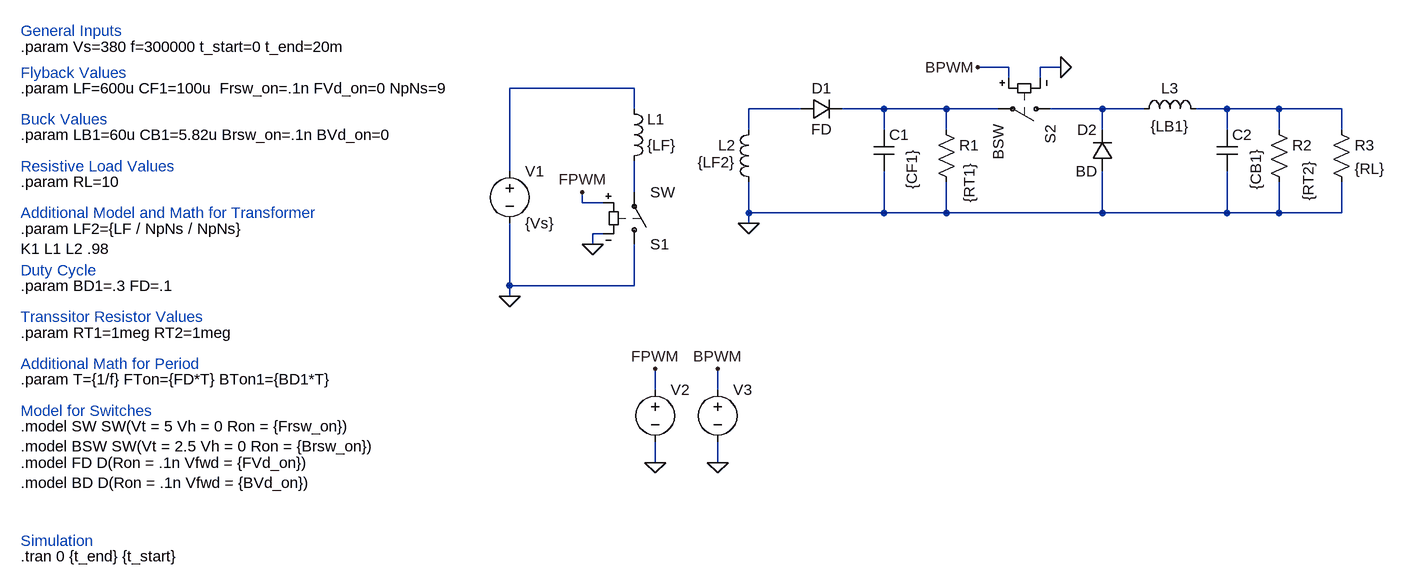
[diagram p0: schematic 1OFlybacktoBuckSPICE.asc]
1OFlybacktoBuckSPICE.asc, the LTspice schematic file:
Version 4.1
SHEET 1 1552 680
WIRE 944 -192 896 -192
WIRE 1024 -192 992 -192
WIRE 944 -176 944 -192
WIRE 992 -176 992 -192
WIRE 368 -160 176 -160
WIRE 368 -128 368 -160
WIRE 624 -128 544 -128
WIRE 752 -128 688 -128
WIRE 848 -128 752 -128
WIRE 928 -128 848 -128
WIRE 1088 -128 1008 -128
WIRE 1152 -128 1088 -128
WIRE 1280 -128 1232 -128
WIRE 1360 -128 1280 -128
WIRE 1456 -128 1360 -128
WIRE 544 -96 544 -128
WIRE 752 -96 752 -128
WIRE 848 -96 848 -128
WIRE 1088 -96 1088 -128
WIRE 1280 -96 1280 -128
WIRE 1360 -96 1360 -128
WIRE 1456 -96 1456 -128
WIRE 176 -32 176 -160
WIRE 368 0 368 -48
WIRE 288 16 288 0
WIRE 320 16 288 16
WIRE 544 32 544 -16
WIRE 752 32 752 -32
WIRE 752 32 544 32
WIRE 848 32 848 -16
WIRE 848 32 752 32
WIRE 1088 32 1088 -32
WIRE 1088 32 848 32
WIRE 1280 32 1280 -32
WIRE 1280 32 1088 32
WIRE 1360 32 1360 -16
WIRE 1360 32 1280 32
WIRE 1456 32 1456 -16
WIRE 1456 32 1360 32
WIRE 544 48 544 32
WIRE 320 64 304 64
WIRE 304 80 304 64
WIRE 176 144 176 48
WIRE 368 144 368 80
WIRE 368 144 176 144
WIRE 176 160 176 144
WIRE 400 304 400 272
WIRE 496 304 496 272
WIRE 400 416 400 384
WIRE 496 416 496 384
FLAG 176 160 0
FLAG 544 48 0
FLAG 304 80 0
FLAG 1024 -192 0
FLAG 400 416 0
FLAG 496 416 0
FLAG 400 272 FPWM
FLAG 496 272 BPWM
FLAG 288 0 FPWM
FLAG 896 -192 BPWM
SYMBOL sw 368 96 M180
SYMATTR InstName S1
SYMBOL ind 352 -32 M180
WINDOW 0 36 80 Left 2
WINDOW 3 36 40 Left 2
SYMATTR InstName L1
SYMATTR Value {LF}
SYMATTR Type ind
SYMBOL ind 560 -112 M0
WINDOW 3 36 66 Left 2
SYMATTR InstName L2
SYMATTR Value {LF2}
SYMATTR Type ind
SYMBOL voltage 176 -48 R0
SYMATTR InstName V1
SYMATTR Value {Vs}
SYMBOL diode 624 -112 R270
WINDOW 0 32 32 VTop 2
WINDOW 3 0 32 VBottom 2
SYMATTR InstName D1
SYMATTR Value FD
SYMBOL cap 736 -96 R0
WINDOW 3 59 92 VLeft 2
SYMATTR InstName C1
SYMATTR Value {CF1}
SYMBOL res 832 -112 R0
WINDOW 3 51 129 VLeft 2
SYMATTR InstName R1
SYMATTR Value {RT1}
SYMBOL sw 1024 -128 R90
SYMATTR InstName S2
SYMATTR Value BSW
SYMBOL diode 1104 -32 R180
WINDOW 0 24 64 Left 2
WINDOW 3 24 0 Left 2
SYMATTR InstName D2
SYMATTR Value BD
SYMBOL ind 1136 -112 R270
WINDOW 0 32 56 VTop 2
WINDOW 3 5 56 VBottom 2
SYMATTR InstName L3
SYMATTR Value {LB1}
SYMBOL cap 1264 -96 R0
WINDOW 3 60 93 VLeft 2
SYMATTR InstName C2
SYMATTR Value {CB1}
SYMBOL res 1344 -112 R0
WINDOW 3 61 126 VLeft 2
SYMATTR InstName R2
SYMATTR Value {RT2}
SYMBOL res 1440 -112 R0
SYMATTR InstName R3
SYMATTR Value {RL}
SYMBOL voltage 400 288 R0
WINDOW 3 24 96 Invisible 2
WINDOW 123 0 0 Left 0
WINDOW 39 0 0 Left 0
SYMATTR InstName V2
SYMATTR Value PULSE(0 10 0 1n 1n {FTon} {T})
SYMBOL voltage 496 288 R0
WINDOW 3 24 96 Invisible 2
WINDOW 123 0 0 Left 0
WINDOW 39 0 0 Left 0
SYMATTR InstName V3
SYMATTR Value PULSE(0 5 0 1n 1n {BTon1} {T})
TEXT -576 -160 Left 2 !.param LF=600u CF1=100u  Frsw_on=.1n FVd_on=0 NpNs=9
TEXT -576 56 Left 2 !.param LF2={LF / NpNs / NpNs}\nK1 L1 L2 .98
TEXT -576 -88 Left 2 !.param LB1=60u CB1=5.82u Brsw_on=.1n BVd_on=0
TEXT -576 -184 Left 2 ;Flyback Values
TEXT -576 -112 Left 2 ;Buck Values
TEXT -576 32 Left 2 ;Additional Model and Math for Transformer
TEXT -576 -224 Left 2 !.param Vs=380 f=300000 t_start=0 t_end=20m
TEXT -576 -248 Left 2 ;General Inputs
TEXT -576 -16 Left 2 !.param RL=10
TEXT -576 -40 Left 2 ;Resistive Load Values
TEXT -576 120 Left 2 ;Duty Cycle
TEXT -576 144 Left 2 !.param BD1=.3 FD=.1
TEXT -576 192 Left 2 ;Transsitor Resistor Values
TEXT -576 216 Left 2 !.param RT1=1meg RT2=1meg
TEXT -576 264 Left 2 ;Additional Math for Period
TEXT -576 288 Left 2 !.param T={1/f} FTon={FD*T} BTon1={BD1*T}
TEXT -576 336 Left 2 ;Model for Switches
TEXT -576 360 Left 2 !.model SW SW(Vt = 5 Vh = 0 Ron = {Frsw_on})\n.model BSW SW(Vt = 2.5 Vh = 0 Ron = {Brsw_on})
TEXT -576 416 Left 2 !.model FD D(Ron = .1n Vfwd = {FVd_on})\n.model BD D(Ron = .1n Vfwd = {BVd_on})
TEXT -576 560 Left 2 !.tran 0 {t_end} {t_start}
TEXT -576 536 Left 2 ;Simulation

The netlist it stands for:
* 1OFlybacktoBuckSPICE.asc
S1 0 N006 FPWM 0 SW
L1 N006 N001 {LF}
L2 N002 0 {LF2}
V1 N001 0 {Vs}
D1 N002 N003 FD
C1 N003 0 {CF1}
R1 N003 0 {RT1}
S2 N004 N003 BPWM 0 BSW
D2 0 N004 BD
L3 N004 N005 {LB1}
C2 N005 0 {CB1}
R2 N005 0 {RT2}
R3 N005 0 {RL}
V2 FPWM 0 PULSE(0 10 0 1n 1n {FTon} {T})
V3 BPWM 0 PULSE(0 5 0 1n 1n {BTon1} {T})
.model D D
.lib standard.dio
.param LF=600u CF1=100u  Frsw_on=.1n FVd_on=0 NpNs=9
.param LF2={LF / NpNs / NpNs}
K1 L1 L2 .98
.param LB1=60u CB1=5.82u Brsw_on=.1n BVd_on=0
* Flyback Values
* Buck Values
* Additional Model and Math for Transformer
.param Vs=380 f=300000 t_start=0 t_end=20m
* General Inputs
.param RL=10
* Resistive Load Values
* Duty Cycle
.param BD1=.3 FD=.1
* Transsitor Resistor Values
.param RT1=1meg RT2=1meg
* Additional Math for Period
.param T={1/f} FTon={FD*T} BTon1={BD1*T}
* Model for Switches
.model SW SW(Vt = 5 Vh = 0 Ron = {Frsw_on})
.model BSW SW(Vt = 2.5 Vh = 0 Ron = {Brsw_on})
.model FD D(Ron = .1n Vfwd = {FVd_on})
.model BD D(Ron = .1n Vfwd = {BVd_on})
.tran 0 {t_end} {t_start}
* Simulation
.backanno
.end